# EAGLE schematic InfoDashboardWithCircoSwitch (EAGLE 9.4.1)
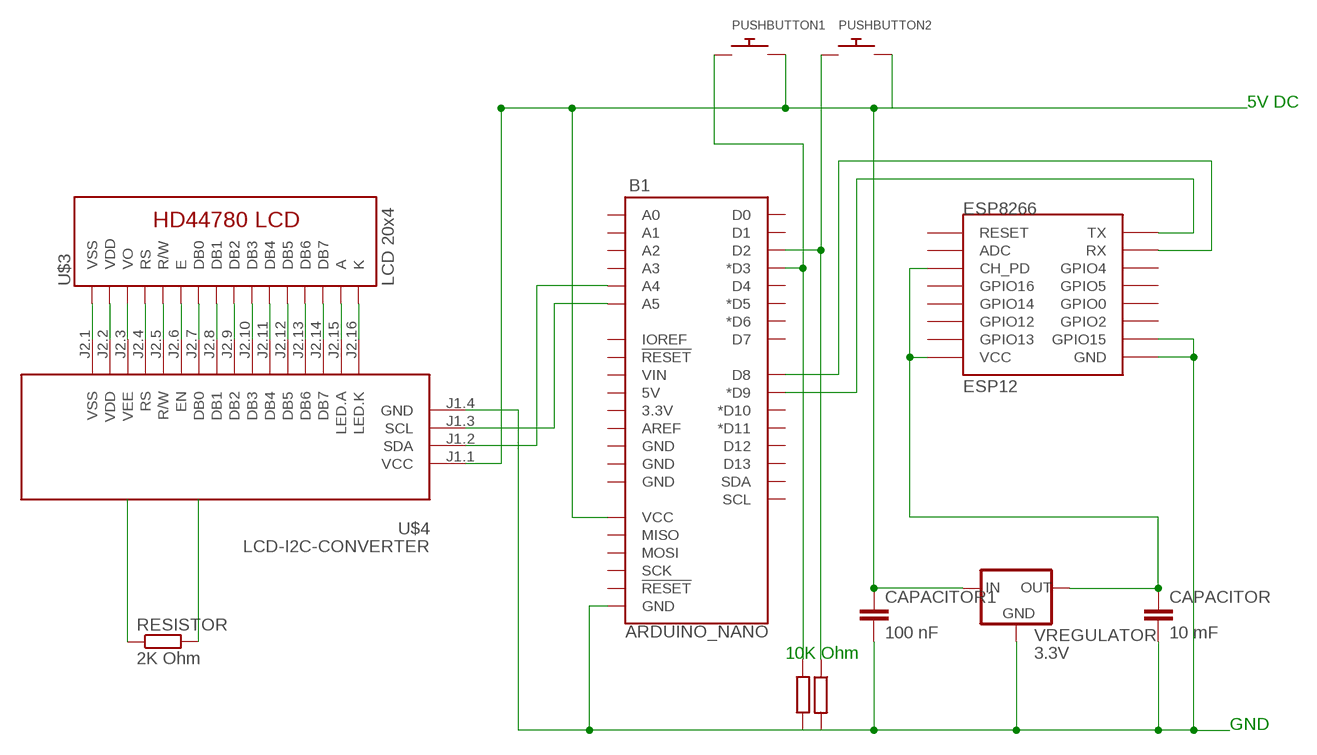
[diagram p0: schematic, sheet 1]

## Parts
B1  ARDUINO_NANO  ARDUINO_UNO_R3  [ARDUINO_R3]
CAPACITOR  10 mF  CAPACITOR_0201_L  [RESC0201_L]
CAPACITOR1  100 nF  CAPACITOR_0201_L  [RESC0201_L]
ESP8266  ESP12  [ESP12]
PUSHBUTTON1  SWITCH_PUSHBUTTONC&K_KSS  [BTN_CK_KSS]
PUSHBUTTON2  SWITCH_PUSHBUTTONC&K_KSS  [BTN_CK_KSS]
RESISTOR  2K Ohm  R  [R0805]
U$3  LCD 20x4  LCD-HD4478016X2-4-HOLES-BL16X2-4-HOLES-BL  [LCD-16X2-4HOLES-BL]
U$4  LCD-I2C-CONVERTER  [LCD-I2C-CONVERTER]
VREGULATOR  3.3V  78LXX  [78LXX]

## Nets
N$1: B1.D9(*D9) ESP8266.TX
N$2: U$3.1(VSS) U$4.J2.1(VSS)
N$3: U$3.2(VDD) U$4.J2.2(VDD)
N$4: U$3.3(VO) U$4.J2.3(VEE)
N$5: U$3.4(RS) U$4.J2.4(RS)
N$6: U$3.5(R/W) U$4.J2.5(R/W)
N$7: U$3.6(E) U$4.J2.6(EN)
N$8: U$3.7(DB0) U$4.J2.7(DB0)
N$9: U$3.8(DB1) U$4.J2.8(DB1)
N$10: U$3.9(DB2) U$4.J2.9(DB2)
N$11: U$3.10(DB3) U$4.J2.10(DB3)
N$12: U$3.11(DB4) U$4.J2.11(DB4)
N$13: U$3.12(DB5) U$4.J2.12(DB5)
N$14: U$3.13(DB6) U$4.J2.13(DB6)
N$15: U$3.14(DB7) U$4.J2.14(DB7)
N$16: U$3.15(A) U$4.J2.15(LED.A)
N$17: U$3.16(K) U$4.J2.16(LED.K)
N$18: B1.A4 U$4.J1.2(SDA)
N$19: B1.GND@1(GND) CAPACITOR1.2 CAPACITOR.2 ESP8266.GND ESP8266.GPIO15 U$4.J1.4(GND) VREGULATOR.GND
N$20: B1.D8 B1.VCC CAPACITOR1.1 ESP8266.RX PUSHBUTTON1.P$2 PUSHBUTTON2.P$2 U$4.J1.1(VCC) VREGULATOR.IN
N$21: CAPACITOR.1 ESP8266.CH_PD ESP8266.VCC VREGULATOR.OUT
N$22: B1.A5 U$4.J1.3(SCL)
N$23: RESISTOR.1
N$24: RESISTOR.2
N$27: B1.D2 PUSHBUTTON2.P$1
N$28: B1.D3(*D3) PUSHBUTTON1.P$1
Unconnected: B1.3.3V B1.5V B1.A0 B1.A1 B1.A2 B1.A3 B1.AREF B1.D0 B1.D1 B1.D4 B1.D5(*D5) B1.D6(*D6) B1.D7 B1.D10(*D10) B1.D11(*D11) B1.D12 B1.D13 B1.GND@2(GND) B1.GND@3(GND) B1.GND@4(GND) B1.IOREF B1.MISO B1.MOSI B1.RESET@1(!RESET!) B1.RESET@2(!RESET!) B1.SCK B1.SCL B1.SDA B1.VIN ESP8266.ADC ESP8266.GPIO0 ESP8266.GPIO2 ESP8266.GPIO4 ESP8266.GPIO5 ESP8266.GPIO12 ESP8266.GPIO13 ESP8266.GPIO14 ESP8266.GPIO16 ESP8266.RESET

## Notes on the sheet
- 5V DC
- 10K Ohm
- GND

## Library data of the parts
B1 = SparkFun-Boards:ARDUINO_UNO_R3: Arduino R3 Footprint with SPI header Arduino Uno R3 Compatible Footprint. Matches PCB size of the original board. SparkFun Products: SAMD21 Dev Breakout <https://www.sparkfun.com/products/13672> RedBoard <https://www.sparkfun.com/products/12757> R3 Stackable Headers <https://www.sparkfun.com/products/11417>
CAPACITOR CAPACITOR1 = Nordic_nRF:CAPACITOR: Generic chip capacitor
ESP8266 = esp8266modules:ESP12: ESP8266 Wifi module 12
PUSHBUTTON1 PUSHBUTTON2 = adafruit:SWITCH_PUSHBUTTON: Buttons SOFTTOUCHSMD_SJ - Soft touch temporary push button (Super Junk Akihabara) Compatible with SKPMANE010 [Mouser: 688-SKPMAN] C&K_KSS = Digikey: KSS221GLFS
RESISTOR = eagle-ltspice:R: RESISTOR, European symbol; SPICEMODEL: NONE; SPICEPREFIX: R
U$3 = HD44780LCD2:LCD-HD44780
U$4 = diy-modules:LCD-I2C-CONVERTER: I2C Bus to 4-Bit Parallel LCD Interface with LED backlight driver
VREGULATOR = DC_LOAD_AU:78LXX: VOLTAGE REGULATOR